# EAGLE design esenode (EAGLE 8.0.1)
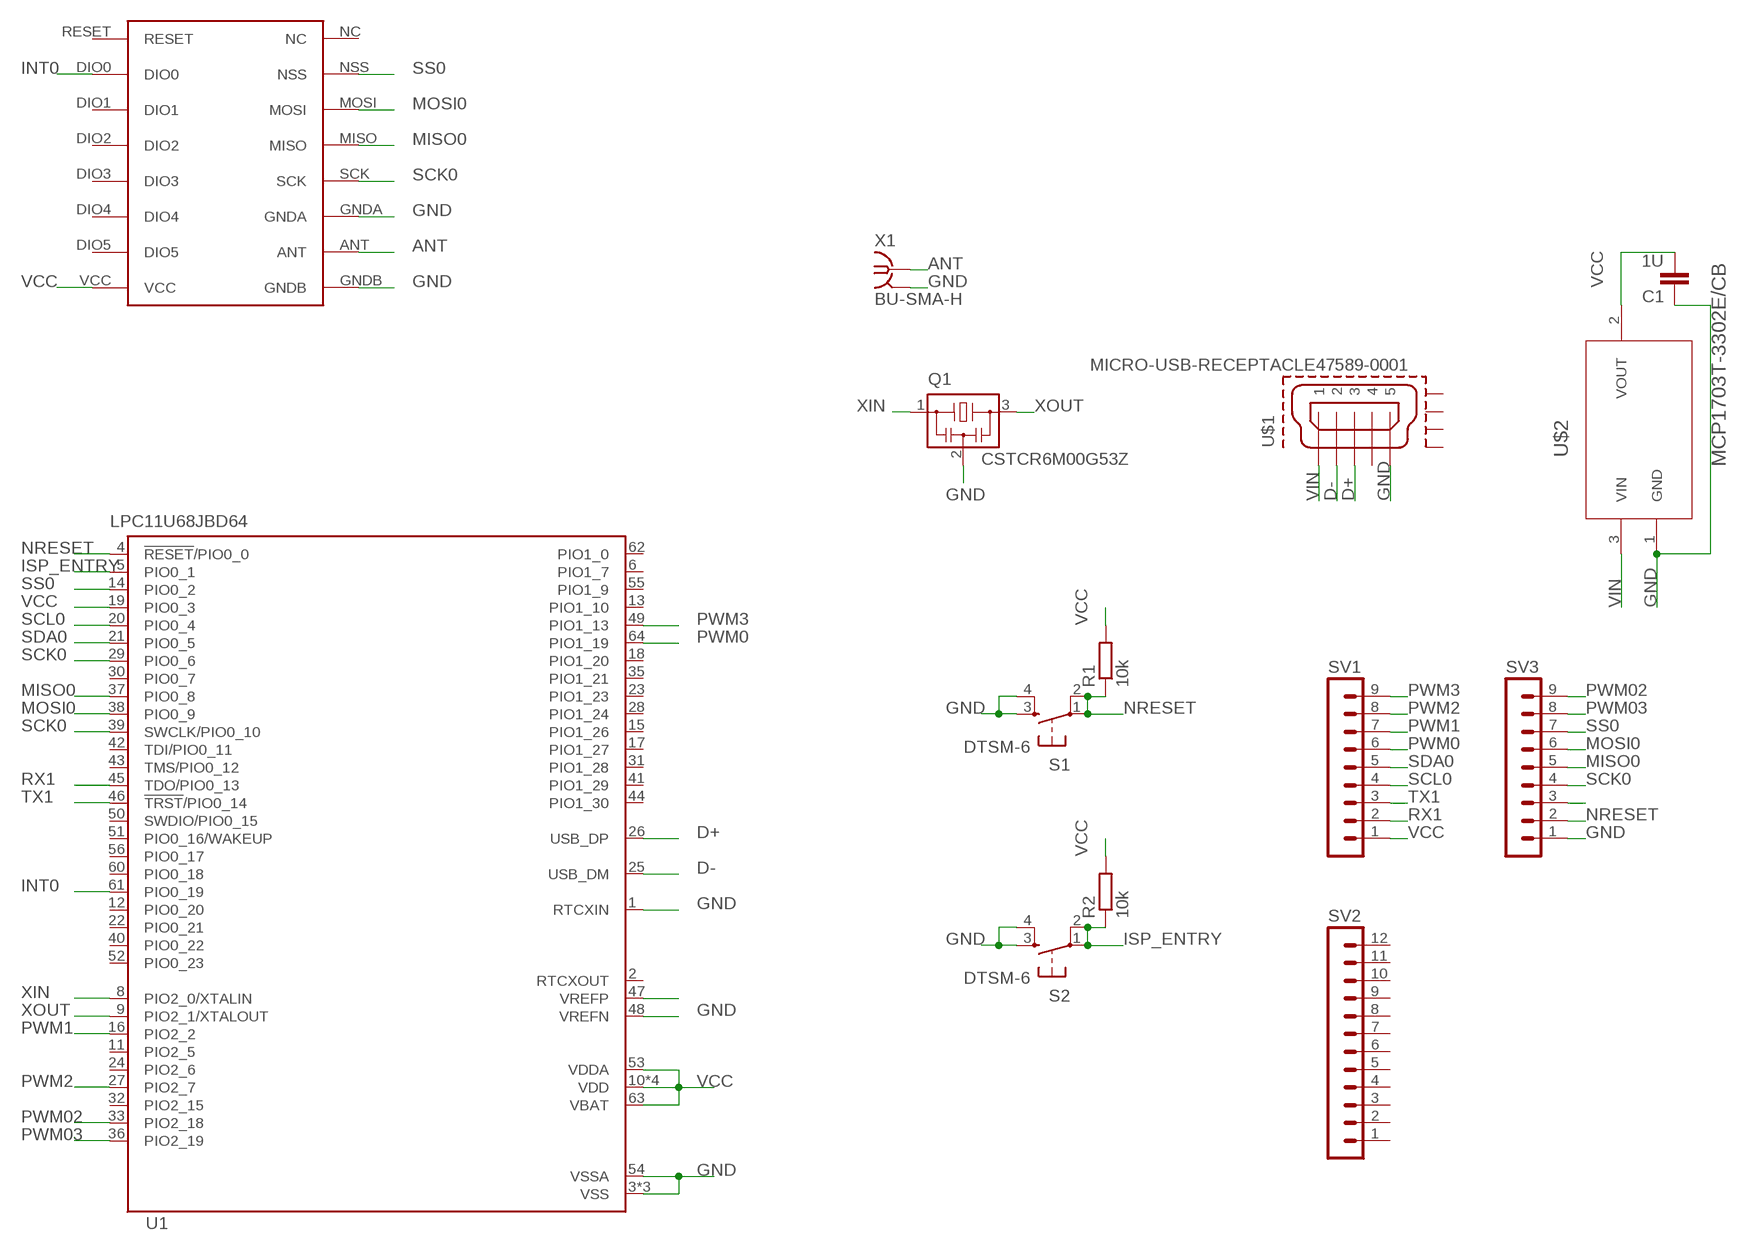
[diagram p0: schematic, sheet 1]

## Parts
C1  1U  C-EUC0805  [C0805]
Q1  CSTCR6M00G53Z  [CSTCR6M]
R1  10k  R-EU_M0805  [M0805]
R2  10k  R-EU_M0805  [M0805]
S1  DTSM-6  [DTSM-6]
S2  DTSM-6  [DTSM-6]
SV1  MA09-1  [MA09-1]
SV2  MA12-1  [MA12-1]
SV3  MA09-1  [MA09-1]
U1  LPC11U68JBD64  [SOT314-2]
U$1  MICRO-USB-RECEPTACLE47589-0001  [47589-0001]
U$2  MCP1703T-3302E/CB  [SOT95P300X145-3N]
U$3  RFM69HW  [RFM]
X1  BU-SMA-H  [BU-SMA-H]

## Nets
ANT: U$3.ANT X1.1
D+: U1.26(USB_DP) U$1.3
D-: U1.25(USB_DM) U$1.2
GND: C1.1 Q1.2 S1.3 S1.4 S2.3 S2.4 SV3.1 U1.1(RTCXIN) U1.3(VSS) U1.7(VSS) U1.48(VREFN) U1.54(VSSA) U1.57(VSS) U$1.5 U$2.1(GND) U$3.GNDA U$3.GNDB X1.2 X1.3 X1.4 X1.5
INT0: U1.61(PIO0_19) U$3.DIO0
ISP_ENTRY: R2.1 S2.1 S2.2 U1.5(PIO0_1)
MISO0: SV3.5 U1.37(PIO0_8) U$3.MISO
MOSI0: SV3.6 U1.38(PIO0_9) U$3.MOSI
N$4: U1.47(VREFP)
N$18: SV3.3
NRESET: R1.1 S1.1 S1.2 SV3.2 U1.4(!RESET!/PIO0_0)
PWM0: SV1.6 U1.64(PIO1_19)
PWM1: SV1.7 U1.16(PIO2_2)
PWM2: SV1.8 U1.27(PIO2_7)
PWM02: SV3.9 U1.33(PIO2_18)
PWM3: SV1.9 U1.49(PIO1_13)
PWM03: SV3.8 U1.36(PIO2_19)
RX1: SV1.2 U1.45(TDO/PIO0_13)
SCK0: SV3.4 U1.29(PIO0_6) U1.39(SWCLK/PIO0_10) U$3.SCK
SCL0: SV1.4 U1.20(PIO0_4)
SDA0: SV1.5 U1.21(PIO0_5)
SS0: SV3.7 U1.14(PIO0_2) U$3.NSS
TX1: SV1.3 U1.46(!TRST!/PIO0_14)
VCC: C1.2 R1.2 R2.2 SV1.1 U1.10(VDD) U1.19(PIO0_3) U1.34(VDD) U1.53(VDDA) U1.58(VDD) U1.59(VDD) U1.63(VBAT) U$2.2(VOUT) U$3.VCC
VIN: U$1.1 U$2.3(VIN)
XIN: Q1.1 U1.8(PIO2_0/XTALIN)
XOUT: Q1.3 U1.9(PIO2_1/XTALOUT)
Unconnected: SV2.1 SV2.2 SV2.3 SV2.4 SV2.5 SV2.6 SV2.7 SV2.8 SV2.9 SV2.10 SV2.11 SV2.12 U1.2(RTCXOUT) U1.6(PIO1_7) U1.11(PIO2_5) U1.12(PIO0_20) U1.13(PIO1_10) U1.15(PIO1_26) U1.17(PIO1_27) U1.18(PIO1_20) U1.22(PIO0_21) U1.23(PIO1_23) U1.24(PIO2_6) U1.28(PIO1_24) U1.30(PIO0_7) U1.31(PIO1_28) U1.32(PIO2_15) U1.35(PIO1_21) U1.40(PIO0_22) U1.41(PIO1_29) U1.42(TDI/PIO0_11) U1.43(TMS/PIO0_12) U1.44(PIO1_30) U1.50(SWDIO/PIO0_15) U1.51(PIO0_16/WAKEUP) U1.52(PIO0_23) U1.55(PIO1_9) U1.56(PIO0_17) U1.60(PIO0_18) U1.62(PIO1_0) U$1.4 U$1.CASING1(GND1) U$1.CASING2(GND2) U$1.CASING3(GND3) U$1.CASING4(GND4) U$3.DIO1 U$3.DIO2 U$3.DIO3 U$3.DIO4 U$3.DIO5 U$3.NC U$3.RESET

## Library data of the parts
C1 = rcl:C-EU: CAPACITOR, European symbol
Q1 = murata-filter:CSTCR: Resonator Source: murata.co.jp; MPN: CSTCR6M00G53-R0; OC_FARNELL: 1170434; OC_NEWARK: 25M8759
R1 R2 = rcl:R-EU_: RESISTOR, European symbol
S1 S2 = switch-tact:DTSM-6
SV1 SV3 = con-lstb:MA09-1: PIN HEADER; OC_FARNELL: unknown; OC_NEWARK: unknown
SV2 = con-lstb:MA12-1: PIN HEADER; OC_FARNELL: unknown; OC_NEWARK: unknown
U1 = NXP_60_26022015:LPC11U68JBD64: 32-bit ARM Cortex-M0+ microcontroller; up to 256 kB flash and 36 kB SRAM; 4 kB EEPROM; USB; 12-bit ADC The LPC11U6x are an ARM Cortex-M0+ based, low-cost 32-bit MCU family operating at CPU frequencies of up to 50 MHz. The LPC11U6x support up to 256 kB of flash memory, a 4 kB EEPROM, and 36 kB of SRAM. The ARM Cortex-M0+ is an easy-to-use, energy-efficient core using a two-stage pipeline and fast single-cycle I/O access. The peripheral complement of the LPC11U6x includes a DMA controller, a CRC engine, one full-speed USB device controller with XTAL-less low-speed mode, two I2C-bus interfaces, up to five USARTs, two SSP interfaces, PWM/timer subsystem with six configurable multi-purpose timers, a Real-Time Clock, one 12-bit ADC, temperature sensor, function-configurable I/O ports, and up to 80 general-purpose I/O pins. AAL Eindhoven MK
U$1 = con-molex-usb:MICRO-USB-RECEPTACLE: MICRO USB RECEPTACLES Micro-USB Receptacles, SMT, Lead-Free from MOLEX <http://www.molex.com/>. (C) 2014 Tomasz Boleslaw CEDRO, cederom@tlen.pl, http://www.tomek.cedro.info. Version 0.1 (2014-01-17): Initial release. Version 0.2 (2014-02-06): Updated 47589-0001 footprint pins/pads/milling. Following devices are included: 1. 47589-0001 Micro-USB AB Receptacle, Bottom Mount, SMT, Lead-Free <http://www.molex.com/molex/products/datasheet.jsp?part=active/0475890001_IO_CONNECTORS.xml> (Technical Drawing <http://www.molex.com/pdm_docs/sd/475890001_sd.pdf>).
U$2 = microchip-vreg:MCP1703T-3302E/CB: Low Quiescent Current LDO Regulator; MPN: MCP1703T-3302E/CB; OC_FARNELL: 1439518; OC_NEWARK: 40M0637; PACKAGE: SOT-3; SUPPLIER: Microchip
U$3 = hoperf:RFM69HW
X1 = con-coax:BU-SMA-H: FEMALE SMA CONNECTOR Radiall; OC_FARNELL: unknown; OC_NEWARK: unknown

## Board
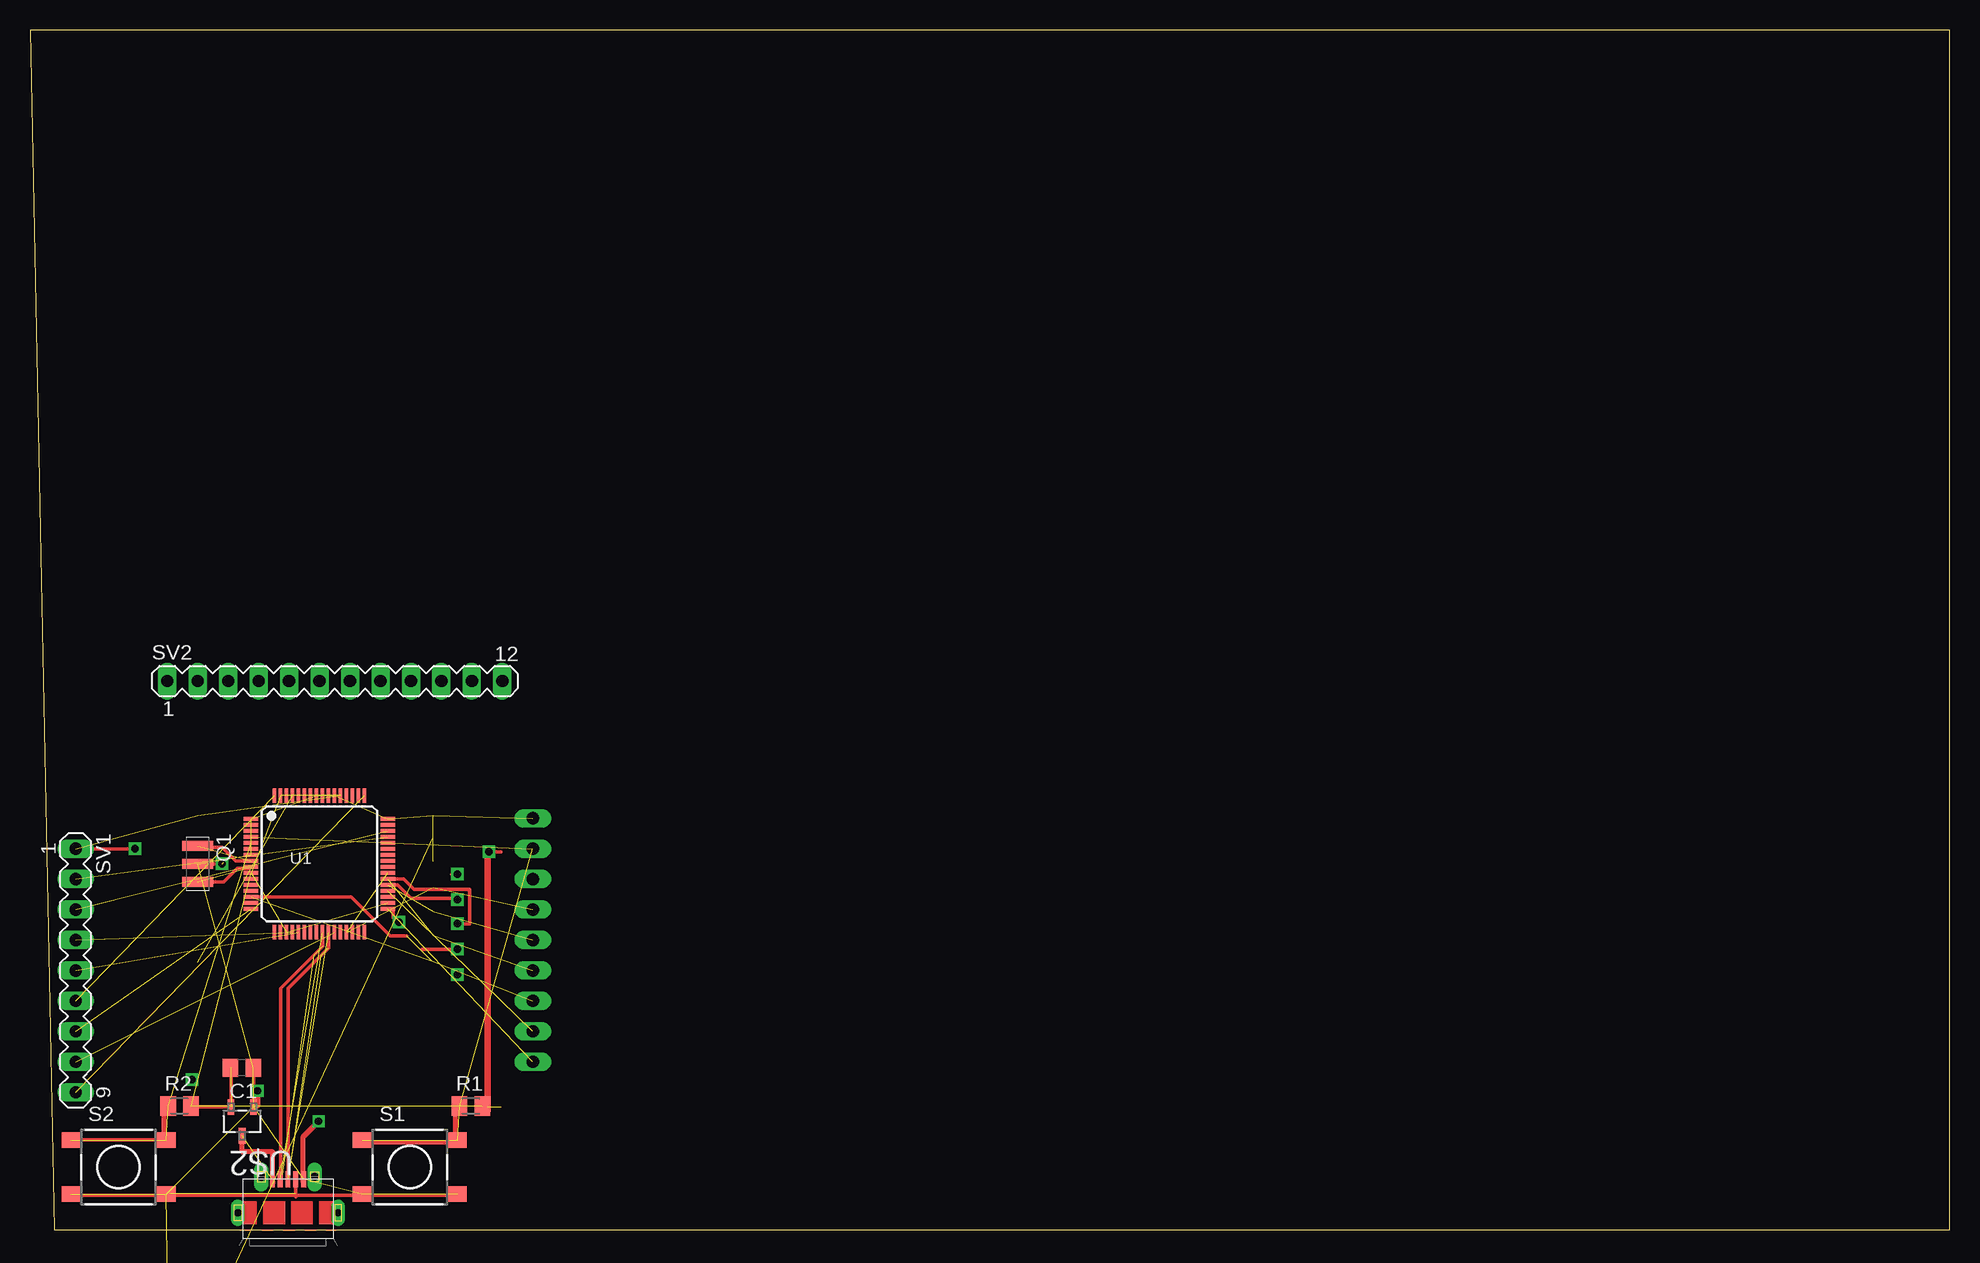
[diagram p1: board, top side]
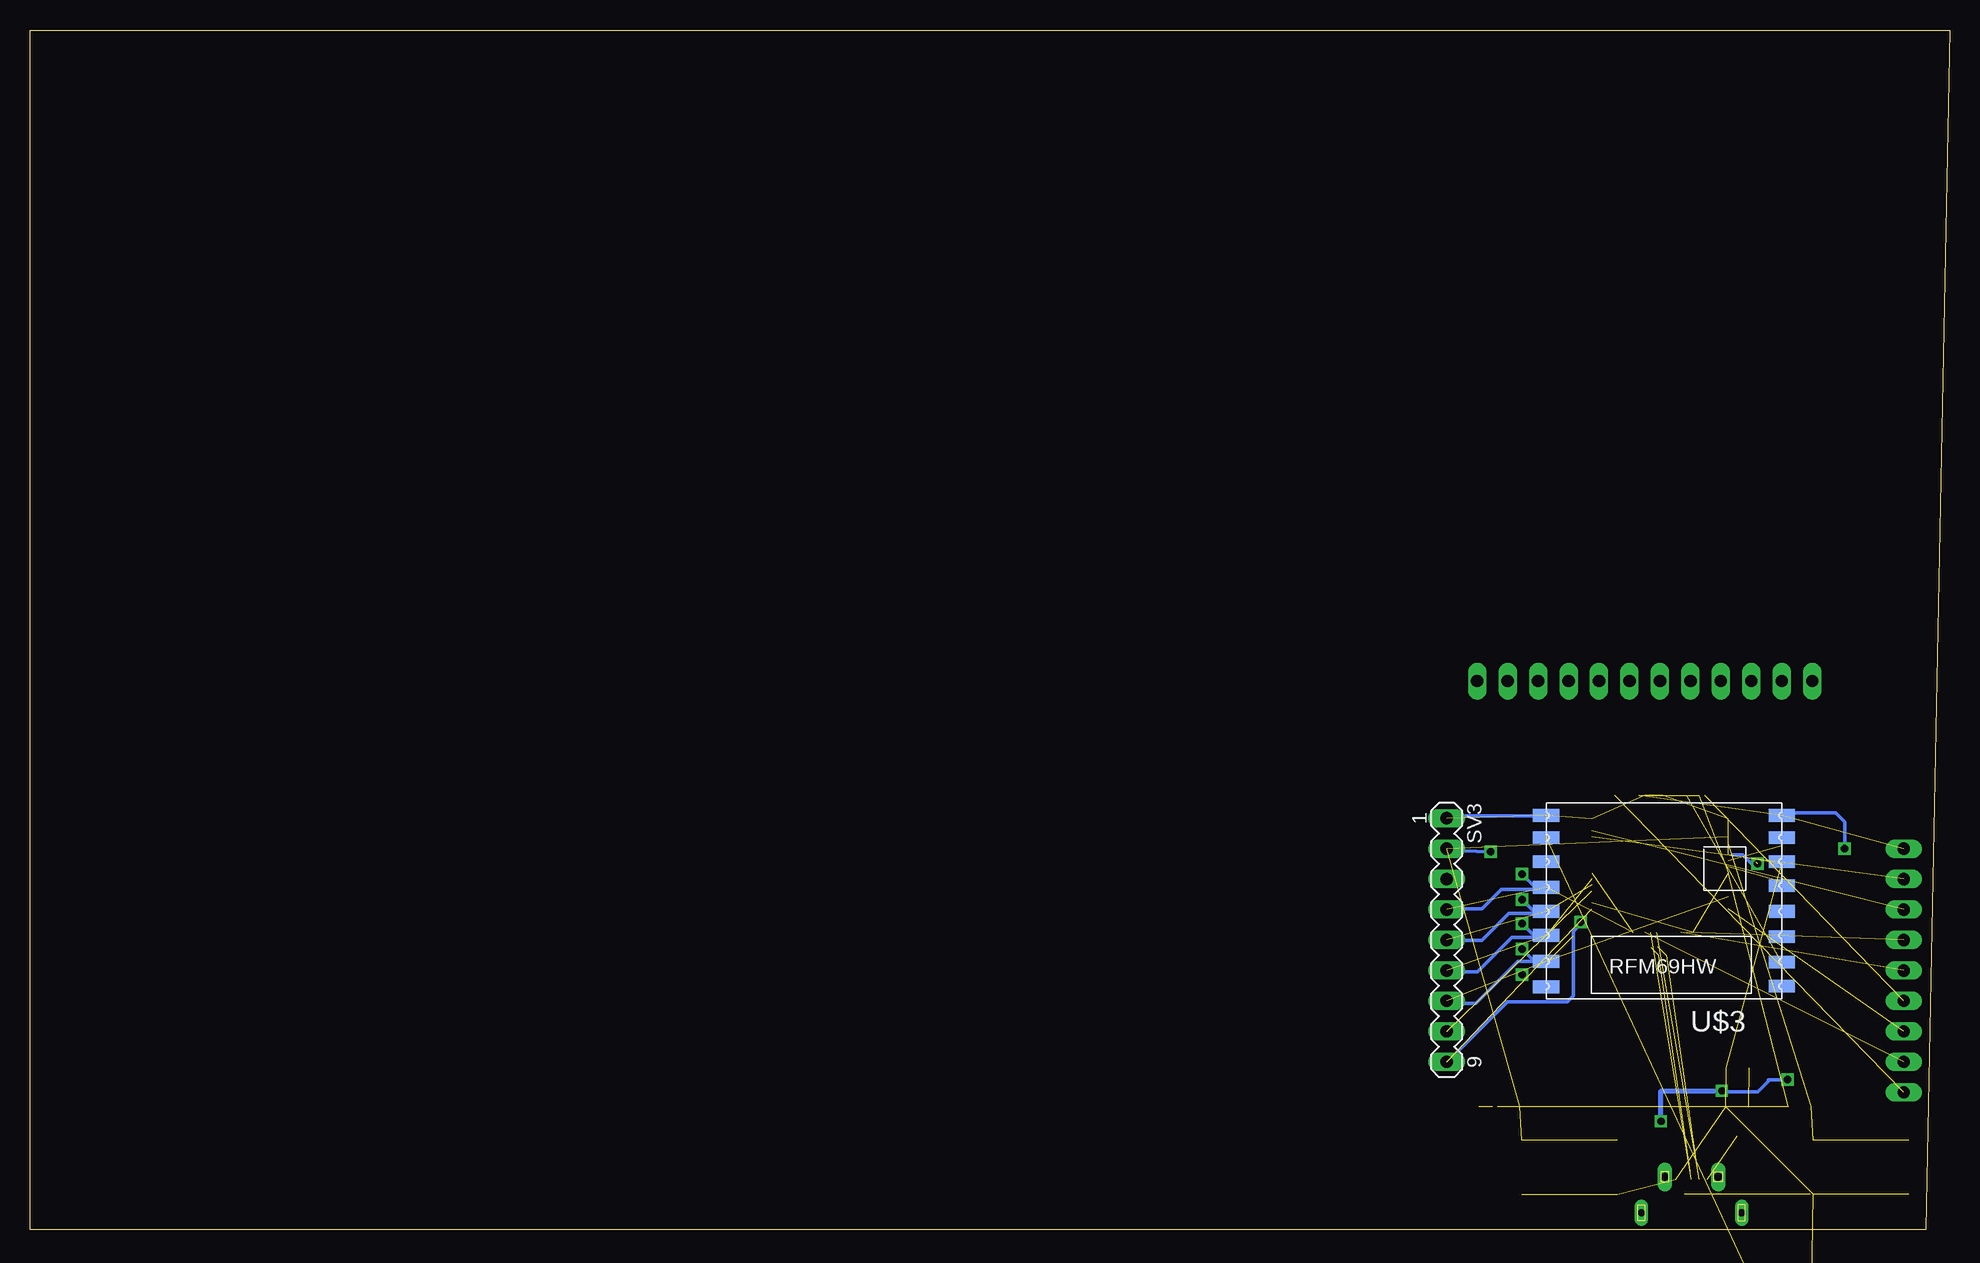
[diagram p2: board, bottom side, seen from below]

Size 160 x 100 mm. Coordinates in mm from the lower left corner, seen from the top.
Outline: 2,0 160,0 160,100 0,100 2,0
Copper layers (1*16): Top 0.035mm / dielectric 1.5mm / Bottom 0.035mm
Design rules "default": minimum track width 10mil, minimum drill 24mil, track to track 8mil, track to pad 8mil, pad to pad 8mil, via to via 8mil, smd to smd 8mil, copper to edge 40mil, drill to drill 8mil, minimum pad ring 10mil, minimum via ring 8mil, stop-mask expansion 4mil, vias tented up to drill 0mil, thermal gap 10mil

### Footprints (pad centres in the part's own frame; a part is rotated, then mirrored left to right if it is on the bottom)
C0805 = smd 1.3 x 1.5: 1 -0.95,0; 2 0.95,0
CSTCR6M = smd 0.8 x 2.6: 1 -1.5,0; 2 0,0; 3 1.5,0
M0805 = smd 1.3 x 1.6: 1 -0.95,0; 2 0.95,0
DTSM-6 = smd 1.55 x 1.3: 1 -3.975,2.25; 2 3.975,2.25; 3 -3.975,-2.25; 4 3.975,-2.25
MA09-1 = drill 1.016 long: 1 -10.16,0; 2 -7.62,0; 3 -5.08,0; 4 -2.54,0; 5 0,0; 6 2.54,0; 7 5.08,0; 8 7.62,0; 9 10.16,0
MA12-1 = drill 1.016 long: 1 -13.97,0; 2 -11.43,0; 3 -8.89,0; 4 -6.35,0; 5 -3.81,0; 6 -1.27,0; 7 1.27,0; 8 3.81,0; 9 6.35,0; 10 8.89,0; 11 11.43,0; 12 13.97,0
SOT314-2 = smd 1.2 x 0.3: 1 -5.7,3.75; 2 -5.7,3.25; 3 -5.7,2.75; 4 -5.7,2.25; 5 -5.7,1.75; 6 -5.7,1.25; 7 -5.7,0.75; 8 -5.7,0.25; 9 -5.7,-0.25; 10 -5.7,-0.75; 11 -5.7,-1.25; 12 -5.7,-1.75; 13 -5.7,-2.25; 14 -5.7,-2.75; 15 -5.7,-3.25; 16 -5.7,-3.75; 33 5.7,-3.75; 34 5.7,-3.25; 35 5.7,-2.75; 36 5.7,-2.25; 37 5.7,-1.75; 38 5.7,-1.25; 39 5.7,-0.75; 40 5.7,-0.25; 41 5.7,0.25; 42 5.7,0.75; 43 5.7,1.25; 44 5.7,1.75; 45 5.7,2.25; 46 5.7,2.75; 47 5.7,3.25; 48 5.7,3.75 | smd 0.3 x 1.2: 17 -3.75,-5.7; 18 -3.25,-5.7; 19 -2.75,-5.7; 20 -2.25,-5.7; 21 -1.75,-5.7; 22 -1.25,-5.7; 23 -0.75,-5.7; 24 -0.25,-5.7; 25 0.25,-5.7; 26 0.75,-5.7; 27 1.25,-5.7; 28 1.75,-5.7; 29 2.25,-5.7; 30 2.75,-5.7; 31 3.25,-5.7; 32 3.75,-5.7; 49 3.75,5.7; 50 3.25,5.7; 51 2.75,5.7; 52 2.25,5.7; 53 1.75,5.7; 54 1.25,5.7; 55 0.75,5.7; 56 0.25,5.7; 57 -0.25,5.7; 58 -0.75,5.7; 59 -1.25,5.7; 60 -1.75,5.7; 61 -2.25,5.7; 62 -2.75,5.7; 63 -3.25,5.7; 64 -3.75,5.7
47589-0001 = smd 1.35 x 0.4: 1 2.8,1.3; 2 2.8,0.65; 3 2.8,0; 4 2.8,-0.65; 5 2.8,-1.3 | drill 0.6 pad 0.95 long: CASING1 0,4.175; CASING2 0,-4.175 | drill 0.7 pad 1.1 long: CASING3 3,2.225; CASING4 3,-2.225
SOT95P300X145-3N = smd 0.559 x 1.321: 1 -0.94,-1.194; 2 0.94,-1.194; 3 0,1.194
RFM = smd 2.184 x 1.067: ANT 19.651,2.889; DIO0 0,13.27; DIO1 0,11.143; DIO2 0,9.047; DIO3 0,6.889; DIO4 0,4.889; DIO5 0,2.889; GNDA 19.651,4.889; GNDB 19.651,1.048; MISO 19.651,9.047; MOSI 19.651,11.047; NC 19.651,15.334; NSS 19.651,13.206; RESET 0,15.27; SCK 19.651,7.048; VCC 0,1.048
BU-SMA-H = drill 1.27: 1 0,0 | drill 1.778: 2 -2.55,2.55; 3 2.55,2.55; 4 2.55,-2.55; 5 -2.55,-2.55

### Placement (x,y rotation side)
C1  17.66,13.47 180 top
Q1  13.97,30.48 270 top
R1  36.74,10.29 0 top
R2  12.47,10.29 0 top
S1  31.66,5.21 0 top
S2  7.39,5.21 0 top
SV1  3.81,21.59 270 top
SV2  25.4,45.72 0 top
SV3  41.91,24.13 270 bottom
U1  24.13,30.48 0 top
U$1  21.5,1.4 90 top
U$2  17.7,9.02 180 top
U$3  13.97,35.56 180 bottom
X1  9.12,-20.12 0 top  (outside the outline)

### Tracks (layer width: path | path; a pad name or v marks a point on that pad's centre or on a via)
ANT  (1 unrouted)
D+  (1 unrouted)
D-  (1 unrouted)
GND  (20 unrouted)
INT0  (1 unrouted)
ISP_ENTRY  (3 unrouted)
MISO0  (2 unrouted)
MOSI0  (2 unrouted)
N$1
  Top 0.406: 11.2,7.75 11.2,10.29
N$2
  Top 0.406: 35.48,7.75 35.48,10.29
N$3
  Top 0.406: 20.23,3.94 20.23,6.47 17.7,6.47 17.7,7.75
N$5  (via drill 0.6)
  Top 0.406: 22.77,3.94 22.77,7.75 v24.05,9.02 | v18.96,11.55 18.96,10.29
  Bottom 0.406: v24.05,9.02 24.05,11.55 v18.96,11.55
N$6
  Top 0.305: 22.12,2.75 22.12,2.88 | 22.12,2.88 11.88,2.88 | 22.12,2.88 27.38,2.88
N$7
  Top 0.305: 16.75,10.62 16.75,13
N$8  (2 unrouted)
  Top 0.305: 24.88,24.25 24.88,23.5 21.5,20.12 21.5,4.5
N$9  (2 unrouted)
  Top 0.305: 24.38,24.25 24.38,23.62 20.88,20.12 20.88,4.62
N$10
  Top 0.305: 14.75,31.88 16,31.88 17.12,30.75 18.12,30.75
N$11
  Top 0.305: 15.12,29 16.12,29 17.25,30.12 18.25,30.12
N$12  (via drill 0.6)
  Bottom 0.305: 18.12,31.25 17.25,31.25 16.5,30.5 16.12,30.5 v16,30.5
N$13  (1 unrouted)
  Top 0.305: 14.88,30.5 16,30.5
N$14
  Bottom 0.305: 18.88,11.5 16,11.5 15,12.5
N$15  (via drill 0.6)
  Bottom 0.305: 15.12,12.5 v13.5,12.5
N$16  (1 unrouted)
  Top 0.305: 22.12,3.75 22.12,3 | 11.62,3 11.5,2.88 3.38,2.88 3.25,2.75
N$17
  Top 0.305: 18.62,10.62 18.62,12.88
N$19
  Bottom 0.305: 34.12,28.38 37.38,28.38 39,26.75 41.25,26.75
N$20
  Top 0.305: 3.62,7.5 11.12,7.5 11.38,7.75
N$21
  Top 0.305: 28,7.25 35,7.25 35.62,7.88
N$22
  Top 0.305: 35.88,2.88 28.25,2.88 28,3.12
N$23
  Top 0.305: 13.75,10.25 16.75,10.25
N$24
  Bottom 0.305: 34.62,26.38 36.75,26.38 39,24.12 41.88,24.12 42,24
N$25
  Bottom 0.305: 42,21.5 39.38,21.5 36.5,24.38 33.75,24.38
N$26  (via drill 0.6)
  Top 0.305: 30,29.25 31.12,29.25 32,28.38 36.62,28.38 36.62,25.5 v35.62,25.5
  Bottom 0.305: v35.62,25.5 34.62,24.5 34.12,24.5
N$27
  Bottom 0.305: 33.62,34.5 41.75,34.5
N$28  (via drill 0.6)  (1 unrouted)
  Top 0.305: v38.25,31.5 38.25,9.88 38,10 38,10.12 38.12,10.25
  Bottom 0.305: 41.88,31.62 v38.25,31.5
N$29
  Top 0.305: 38.12,10.38 38,10.5 38,31.5 39.25,31.5
N$30  (1 unrouted)
  Top 0.305: 31.38,24.5 30,24.5 26.75,27.75 18.75,27.75
N$31  (via drill 0.6)
  Bottom 0.305: 42,13.88 36.88,19 31.88,19 31.38,19.5 31.38,24.88 30.75,25.5 v30.75,25.62
N$32  (via drill 0.6)
  Top 0.305: 3.75,31.62 3.88,31.75 v8.75,31.75 8.88,31.75
  Bottom 0.305: 13.25,34.75 9.5,34.75 8.75,34 v8.75,31.75
N$33
  Top 0.305: 30.62,25.62 30.25,26 30.25,26.75
N$34
  Bottom 0.305: 42.25,34.25 42,34.5 41.88,34.38 41.75,34.38 41.62,34.38 41.88,34.12 42,34.12 42,34.25
N$35  (via drill 0.6)
  Top 0.305: v35.62,29.62 35.12,29.62
  Bottom 0.305: v35.62,29.62 34.62,28.62 34.38,28.62
N$36  (via drill 0.6)
  Top 0.305: v35.62,27.5 35.5,27.62 31.75,27.62 30.62,28.75 30,28.75
  Bottom 0.305: v35.62,27.5 34.5,26.38 34.12,26.38
N$38  (via drill 0.6)
  Top 0.305: 32.62,23.38 v35.62,23.38
  Bottom 0.305: 33.5,22.38 34.25,22.38 34.62,22.38 | 34.62,22.38 36,22.38 39.5,18.88 41.88,18.88 42,19 | v35.62,23.38 34.62,22.38
N$39  (via drill 0.6)
  other vias: 35.62,21.25
NRESET  (4 unrouted)
PWM0  (1 unrouted)
PWM1  (1 unrouted)
PWM2  (1 unrouted)
PWM02  (1 unrouted)
PWM3  (1 unrouted)
PWM03  (1 unrouted)
RX1  (1 unrouted)
SCK0  (3 unrouted)
SCL0  (1 unrouted)
SDA0  (1 unrouted)
SS0  (2 unrouted)
TX1  (1 unrouted)
VCC  (12 unrouted)
VIN  (1 unrouted)
XIN  (1 unrouted)
XOUT  (1 unrouted)